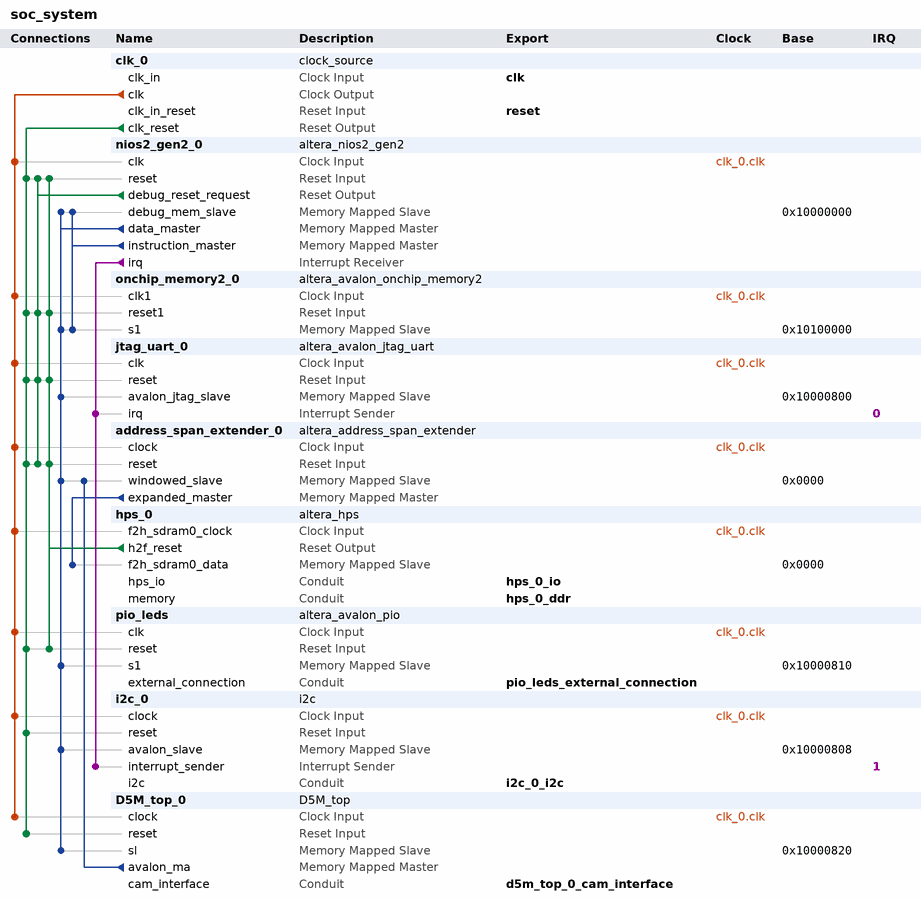
[diagram p0: system contents]
# Platform Designer (Qsys) system soc_system, Cyclone V 5CSEMA4U23C6
# Parameters at their usual value, and those the tool derives, are not listed.
package require -exact qsys 18.1
create_system soc_system
set_project_property DEVICE_FAMILY {Cyclone V}
set_project_property DEVICE 5CSEMA4U23C6

add_instance clk_0 clock_source 18.1
set_instance_parameter_value clk_0 clockFrequency 50000000

add_instance nios2_gen2_0 altera_nios2_gen2 18.1
set_instance_parameter_value nios2_gen2_0 dcache_size 2048
set_instance_parameter_value nios2_gen2_0 exceptionSlave onchip_memory2_0.s1
set_instance_parameter_value nios2_gen2_0 icache_size 4096
set_instance_parameter_value nios2_gen2_0 impl Fast
set_instance_parameter_value nios2_gen2_0 resetSlave onchip_memory2_0.s1

add_instance onchip_memory2_0 altera_avalon_onchip_memory2 18.1
set_instance_parameter_value onchip_memory2_0 dataWidth 32
set_instance_parameter_value onchip_memory2_0 dualPort false
set_instance_parameter_value onchip_memory2_0 initMemContent true
set_instance_parameter_value onchip_memory2_0 initializationFileName onchip_mem.hex
set_instance_parameter_value onchip_memory2_0 memorySize 131072

add_instance jtag_uart_0 altera_avalon_jtag_uart 18.1
set_instance_parameter_value jtag_uart_0 simInteractiveOptions NO_INTERACTIVE_WINDOWS

add_instance address_span_extender_0 altera_address_span_extender 18.1
set_instance_parameter_value address_span_extender_0 BURSTCOUNT_WIDTH 7
set_instance_parameter_value address_span_extender_0 DATA_WIDTH 32
set_instance_parameter_value address_span_extender_0 ENABLE_SLAVE_PORT false
set_instance_parameter_value address_span_extender_0 MASTER_ADDRESS_DEF 805306368
set_instance_parameter_value address_span_extender_0 MAX_PENDING_READS 1
set_instance_parameter_value address_span_extender_0 SLAVE_ADDRESS_WIDTH 26

add_instance hps_0 altera_hps 18.1
set_instance_parameter_value hps_0 EMAC1_Mode RGMII
set_instance_parameter_value hps_0 EMAC1_PinMuxing {HPS I/O Set 0}
set_instance_parameter_value hps_0 F2SCLK_COLDRST_Enable false
set_instance_parameter_value hps_0 F2SCLK_DBGRST_Enable false
set_instance_parameter_value hps_0 F2SCLK_WARMRST_Enable false
set_instance_parameter_value hps_0 F2SDRAM_Type {Avalon-MM Bidirectional}
set_instance_parameter_value hps_0 F2SDRAM_Width 32
set_instance_parameter_value hps_0 F2SINTERRUPT_Enable false
set_instance_parameter_value hps_0 F2S_Width 0
set_instance_parameter_value hps_0 FPGA_PERIPHERAL_OUTPUT_CLOCK_FREQ_EMAC0_GTX_CLK 125
set_instance_parameter_value hps_0 FPGA_PERIPHERAL_OUTPUT_CLOCK_FREQ_EMAC0_MD_CLK 2.5
set_instance_parameter_value hps_0 FPGA_PERIPHERAL_OUTPUT_CLOCK_FREQ_EMAC1_GTX_CLK 125
set_instance_parameter_value hps_0 FPGA_PERIPHERAL_OUTPUT_CLOCK_FREQ_EMAC1_MD_CLK 2.5
set_instance_parameter_value hps_0 HPS_PROTOCOL DDR3
set_instance_parameter_value hps_0 I2C0_Mode I2C
set_instance_parameter_value hps_0 I2C0_PinMuxing {HPS I/O Set 0}
set_instance_parameter_value hps_0 I2C1_Mode I2C
set_instance_parameter_value hps_0 I2C1_PinMuxing {HPS I/O Set 0}
set_instance_parameter_value hps_0 LWH2F_Enable false
set_instance_parameter_value hps_0 MEM_BANKADDR_WIDTH 3
set_instance_parameter_value hps_0 MEM_CLK_FREQ 400.0
set_instance_parameter_value hps_0 MEM_COL_ADDR_WIDTH 10
set_instance_parameter_value hps_0 MEM_DQ_WIDTH 32
set_instance_parameter_value hps_0 MEM_DRV_STR RZQ/6
set_instance_parameter_value hps_0 MEM_ROW_ADDR_WIDTH 15
set_instance_parameter_value hps_0 MEM_RTT_NOM RZQ/6
set_instance_parameter_value hps_0 MEM_RTT_WR {Dynamic ODT off}
set_instance_parameter_value hps_0 MEM_TCL 7
set_instance_parameter_value hps_0 MEM_TFAW_NS 37.5
set_instance_parameter_value hps_0 MEM_TRAS_NS 35.0
set_instance_parameter_value hps_0 MEM_TRCD_NS 13.75
set_instance_parameter_value hps_0 MEM_TRFC_NS 300.0
set_instance_parameter_value hps_0 MEM_TRP_NS 13.75
set_instance_parameter_value hps_0 MEM_VENDOR Other
set_instance_parameter_value hps_0 MEM_WTCL 7
set_instance_parameter_value hps_0 QSPI_Mode N/A
set_instance_parameter_value hps_0 QSPI_PinMuxing Unused
set_instance_parameter_value hps_0 REF_CLK_FREQ 25.0
set_instance_parameter_value hps_0 S2FCLK_USER2CLK 1
set_instance_parameter_value hps_0 S2F_Width 0
set_instance_parameter_value hps_0 SDIO_Mode {4-bit Data}
set_instance_parameter_value hps_0 SDIO_PinMuxing {HPS I/O Set 0}
set_instance_parameter_value hps_0 SPIM1_Mode {Single Slave Select}
set_instance_parameter_value hps_0 SPIM1_PinMuxing {HPS I/O Set 0}
set_instance_parameter_value hps_0 STM_Enable false
set_instance_parameter_value hps_0 TIMING_BOARD_AC_SKEW 0.02
set_instance_parameter_value hps_0 TIMING_BOARD_AC_TO_CK_SKEW 0.0
set_instance_parameter_value hps_0 TIMING_BOARD_DQ_TO_DQS_SKEW 0.0
set_instance_parameter_value hps_0 TIMING_BOARD_MAX_CK_DELAY 0.6
set_instance_parameter_value hps_0 TIMING_BOARD_MAX_DQS_DELAY 0.6
set_instance_parameter_value hps_0 TIMING_BOARD_SKEW_BETWEEN_DQS 0.02
set_instance_parameter_value hps_0 TIMING_BOARD_SKEW_CKDQS_DIMM_MAX 0.01
set_instance_parameter_value hps_0 TIMING_BOARD_SKEW_CKDQS_DIMM_MIN -0.01
set_instance_parameter_value hps_0 TIMING_BOARD_SKEW_WITHIN_DQS 0.02
set_instance_parameter_value hps_0 TIMING_TDH 125
set_instance_parameter_value hps_0 TIMING_TDQSCK 400
set_instance_parameter_value hps_0 TIMING_TDQSQ 120
set_instance_parameter_value hps_0 TIMING_TDS 50
set_instance_parameter_value hps_0 TIMING_TIH 250
set_instance_parameter_value hps_0 TIMING_TIS 175
set_instance_parameter_value hps_0 TIMING_TQSH 0.38
set_instance_parameter_value hps_0 UART0_Mode {No Flow Control}
set_instance_parameter_value hps_0 UART0_PinMuxing {HPS I/O Set 0}
set_instance_parameter_value hps_0 USB1_Mode SDR
set_instance_parameter_value hps_0 USB1_PinMuxing {HPS I/O Set 0}
set_instance_parameter_value hps_0 desired_cfg_clk_mhz 100.0
set_instance_parameter_value hps_0 desired_qspi_clk_mhz 400.0

add_instance pio_leds altera_avalon_pio 18.1
set_instance_parameter_value pio_leds direction Output
set_instance_parameter_value pio_leds resetValue 170
set_instance_parameter_value pio_leds width 8

add_instance i2c_0 i2c 15.1

add_instance D5M_top_0 D5M_top 1.0
set_instance_parameter_value D5M_top_0 AvalonAddressDepth 64
set_instance_parameter_value D5M_top_0 AvalonBustDepth 7
set_instance_parameter_value D5M_top_0 AvalonBustN 16
set_instance_parameter_value D5M_top_0 AvalonDataDepth 32
set_instance_parameter_value D5M_top_0 FifoCountDepth 7
set_instance_parameter_value D5M_top_0 LcdNPixel 76800
set_instance_parameter_value D5M_top_0 PixelCountDepth 20
set_instance_parameter_value D5M_top_0 PixelDepth 16

# connections
add_connection clk_0.clk address_span_extender_0.clock clock
add_connection clk_0.clk D5M_top_0.clock clock
add_connection clk_0.clk hps_0.f2h_sdram0_clock clock
add_connection clk_0.clk i2c_0.clock clock
add_connection clk_0.clk jtag_uart_0.clk clock
add_connection clk_0.clk nios2_gen2_0.clk clock
add_connection clk_0.clk onchip_memory2_0.clk1 clock
add_connection clk_0.clk pio_leds.clk clock
add_connection clk_0.clk_reset address_span_extender_0.reset reset
add_connection clk_0.clk_reset D5M_top_0.reset reset
add_connection clk_0.clk_reset i2c_0.reset reset
add_connection clk_0.clk_reset jtag_uart_0.reset reset
add_connection clk_0.clk_reset nios2_gen2_0.reset reset
add_connection clk_0.clk_reset onchip_memory2_0.reset1 reset
add_connection clk_0.clk_reset pio_leds.reset reset
add_connection hps_0.h2f_reset address_span_extender_0.reset reset
add_connection hps_0.h2f_reset jtag_uart_0.reset reset
add_connection hps_0.h2f_reset nios2_gen2_0.reset reset
add_connection hps_0.h2f_reset onchip_memory2_0.reset1 reset
add_connection hps_0.h2f_reset pio_leds.reset reset
add_connection nios2_gen2_0.debug_reset_request address_span_extender_0.reset reset
add_connection nios2_gen2_0.debug_reset_request jtag_uart_0.reset reset
add_connection nios2_gen2_0.debug_reset_request nios2_gen2_0.reset reset
add_connection nios2_gen2_0.debug_reset_request onchip_memory2_0.reset1 reset
add_connection address_span_extender_0.expanded_master hps_0.f2h_sdram0_data avalon
set_connection_parameter_value address_span_extender_0.expanded_master/hps_0.f2h_sdram0_data baseAddress 0x0000
add_connection D5M_top_0.avalon_ma address_span_extender_0.windowed_slave avalon
set_connection_parameter_value D5M_top_0.avalon_ma/address_span_extender_0.windowed_slave baseAddress 0x0000
add_connection nios2_gen2_0.data_master address_span_extender_0.windowed_slave avalon
set_connection_parameter_value nios2_gen2_0.data_master/address_span_extender_0.windowed_slave baseAddress 0x0000
add_connection nios2_gen2_0.data_master D5M_top_0.sl avalon
set_connection_parameter_value nios2_gen2_0.data_master/D5M_top_0.sl baseAddress 0x10000820
add_connection nios2_gen2_0.data_master i2c_0.avalon_slave avalon
set_connection_parameter_value nios2_gen2_0.data_master/i2c_0.avalon_slave baseAddress 0x10000808
add_connection nios2_gen2_0.data_master jtag_uart_0.avalon_jtag_slave avalon
set_connection_parameter_value nios2_gen2_0.data_master/jtag_uart_0.avalon_jtag_slave baseAddress 0x10000800
add_connection nios2_gen2_0.data_master nios2_gen2_0.debug_mem_slave avalon
set_connection_parameter_value nios2_gen2_0.data_master/nios2_gen2_0.debug_mem_slave baseAddress 0x10000000
add_connection nios2_gen2_0.data_master onchip_memory2_0.s1 avalon
set_connection_parameter_value nios2_gen2_0.data_master/onchip_memory2_0.s1 baseAddress 0x10100000
add_connection nios2_gen2_0.data_master pio_leds.s1 avalon
set_connection_parameter_value nios2_gen2_0.data_master/pio_leds.s1 baseAddress 0x10000810
add_connection nios2_gen2_0.instruction_master nios2_gen2_0.debug_mem_slave avalon
set_connection_parameter_value nios2_gen2_0.instruction_master/nios2_gen2_0.debug_mem_slave baseAddress 0x10000000
add_connection nios2_gen2_0.instruction_master onchip_memory2_0.s1 avalon
set_connection_parameter_value nios2_gen2_0.instruction_master/onchip_memory2_0.s1 baseAddress 0x10100000
add_connection nios2_gen2_0.irq i2c_0.interrupt_sender interrupt
set_connection_parameter_value nios2_gen2_0.irq/i2c_0.interrupt_sender irqNumber 1
add_connection nios2_gen2_0.irq jtag_uart_0.irq interrupt
set_connection_parameter_value nios2_gen2_0.irq/jtag_uart_0.irq irqNumber 0

# exported interfaces
add_interface clk clock sink
set_interface_property clk EXPORT_OF clk_0.clk_in
add_interface d5m_top_0_cam_interface conduit end
set_interface_property d5m_top_0_cam_interface EXPORT_OF D5M_top_0.cam_interface
add_interface hps_0_ddr conduit end
set_interface_property hps_0_ddr EXPORT_OF hps_0.memory
add_interface hps_0_io conduit end
set_interface_property hps_0_io EXPORT_OF hps_0.hps_io
add_interface i2c_0_i2c conduit end
set_interface_property i2c_0_i2c EXPORT_OF i2c_0.i2c
add_interface pio_leds_external_connection conduit end
set_interface_property pio_leds_external_connection EXPORT_OF pio_leds.external_connection
add_interface reset reset sink
set_interface_property reset EXPORT_OF clk_0.clk_in_reset

set_interconnect_requirement {$system} qsys_mm.clockCrossingAdapter HANDSHAKE
set_interconnect_requirement {$system} qsys_mm.enableEccProtection FALSE
set_interconnect_requirement {$system} qsys_mm.insertDefaultSlave FALSE
set_interconnect_requirement {$system} qsys_mm.maxAdditionalLatency 1

save_system soc_system.qsys
